# EAGLE design Z05_C8V_03 (EAGLE 6.3)
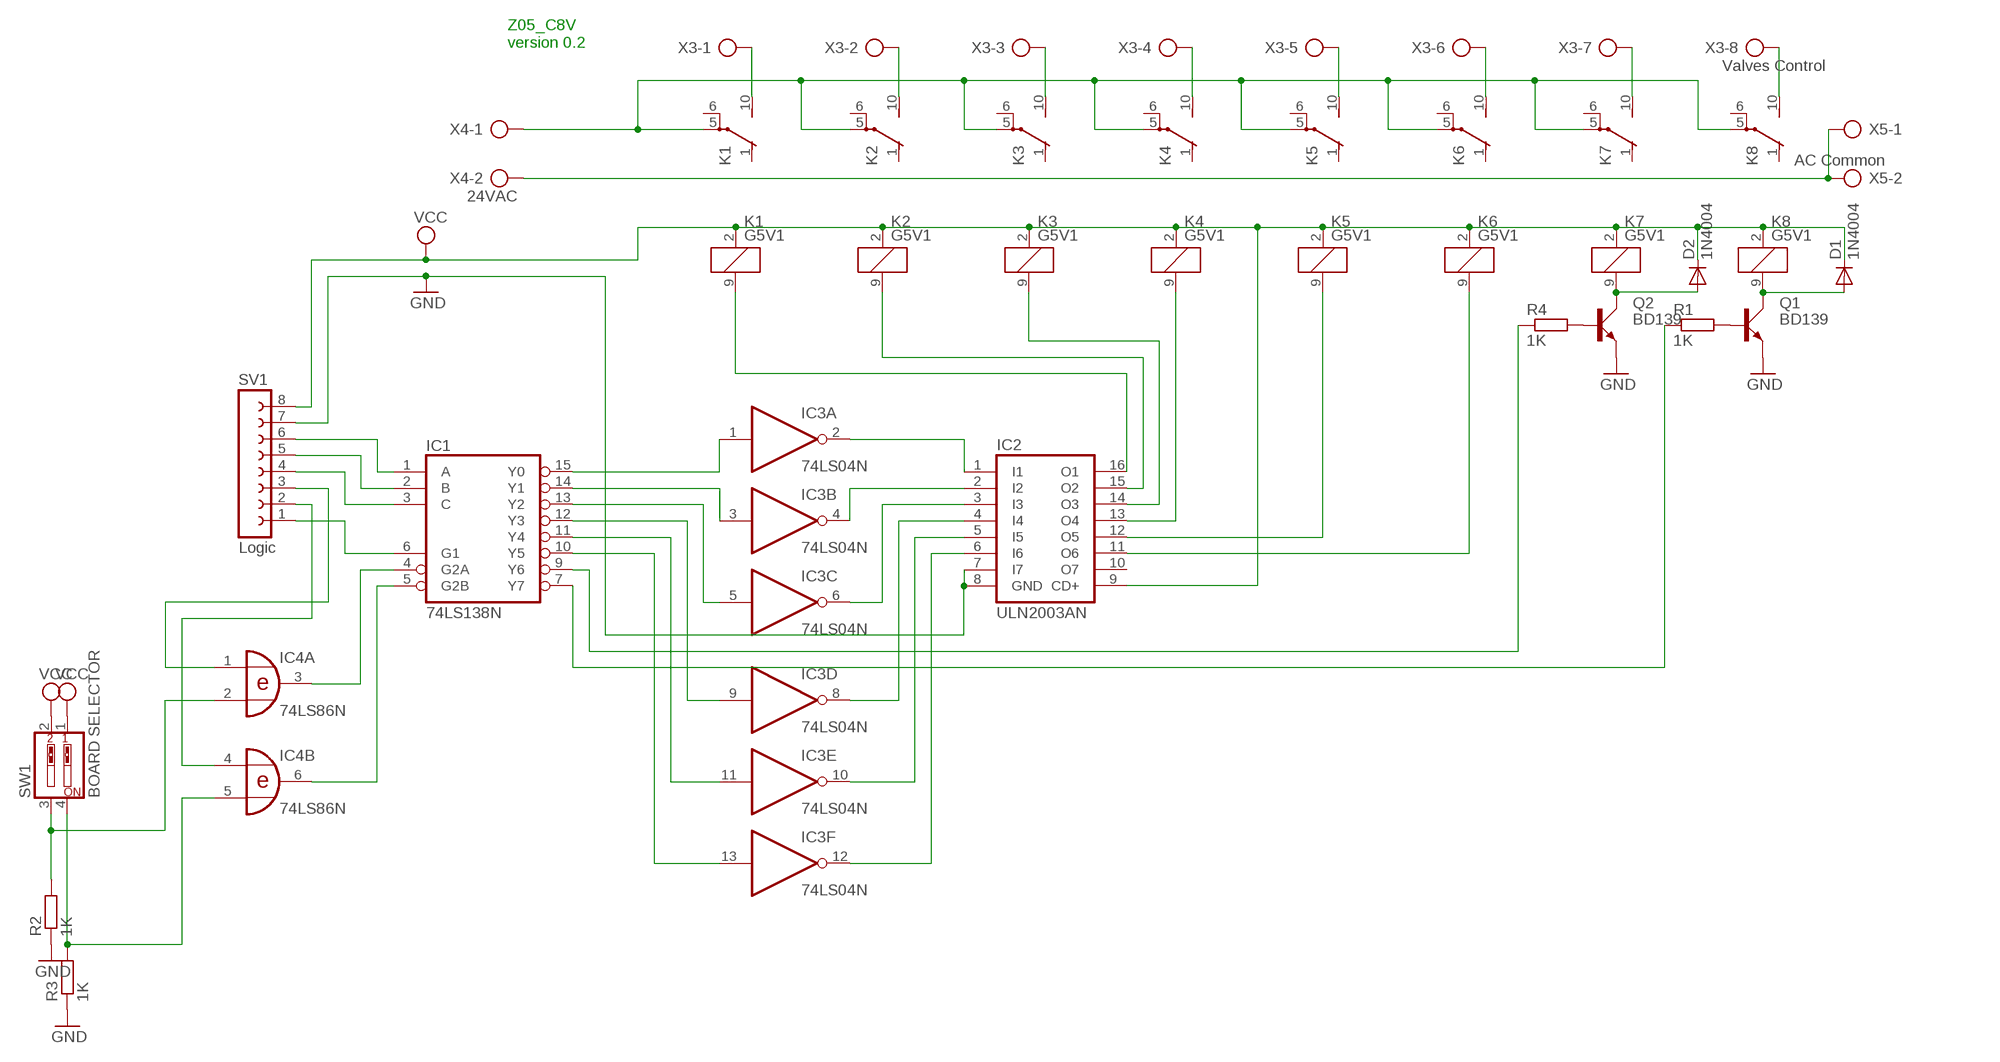
[diagram p0: schematic, sheet 1]

## Parts
D1  1N4004  [DO41-10]
D2  1N4004  [DO41-10]
IC1  74LS138N  [DIL16]
IC2  ULN2003AN  [DIL16]
IC3  74LS04N  [DIL14]
IC4  74LS86N  [DIL14]
K1  G5V1  [G5V1]
K2  G5V1  [G5V1]
K3  G5V1  [G5V1]
K4  G5V1  [G5V1]
K5  G5V1  [G5V1]
K6  G5V1  [G5V1]
K7  G5V1  [G5V1]
K8  G5V1  [G5V1]
Q1  BD139  [TO126AV]
Q2  BD139  [TO126AV]
R1  1K  R-EU_0204/7  [0204/7]
R2  1K  R-EU_0204/7  [0204/7]
R3  1K  R-EU_0204/7  [0204/7]
R4  1K  R-EU_0204/7  [0204/7]
SV1  Logic  FE08-1  [FE08]
SW1  BOARD SELECTOR  SW_DIP-2  [EDG-02]
X3  Valves Control  AK500/8  [AK500/8]
X4  24VAC  AK500/2  [AK500/2]
X5  AC Common  AK500/2  [AK500/2]

## Nets
GND: IC2.7(I7) IC2.8(GND) Q1.E Q2.E R2.1 R3.1 SV1.7
N$1: IC2.15(O2) K2.9
N$2: IC1.15(Y0) IC3.1(A:I)
N$3: IC1.14(Y1) IC3.3(B:I)
N$4: IC1.13(Y2) IC3.5(C:I)
N$5: IC1.12(Y3) IC3.9(D:I)
N$6: IC1.11(Y4) IC3.11(E:I)
N$7: IC1.10(Y5) IC3.13(F:I)
N$8: K1.5(2:P) K2.5(2:P) K3.5(2:P) K4.5(2:P) K5.5(2:P) K6.5(2:P) K7.5(2:P) K8.5(2:P) X4.1
N$9: IC4.1(A:I0) SV1.3
N$10: X4.2 X5.1 X5.2
N$11: K1.10(2:S) X3.1
N$12: K2.10(2:S) X3.2
N$13: K3.10(2:S) X3.3
N$14: K4.10(2:S) X3.4
N$15: K5.10(2:S) X3.5
N$16: K6.10(2:S) X3.6
N$17: K7.10(2:S) X3.7
N$18: K8.10(2:S) X3.8
N$19: IC4.4(B:I0) SV1.2
N$20: D1.A K8.9 Q1.C
N$21: IC2.16(O1) K1.9
N$22: Q1.B R1.2
N$23: IC1.7(Y7) R1.1
N$24: IC2.14(O3) K3.9
N$25: IC2.13(O4) K4.9
N$26: IC2.12(O5) K5.9
N$27: IC2.11(O6) K6.9
N$28: IC1.9(Y6) R4.1
N$29: D2.A K7.9 Q2.C
N$30: IC4.5(B:I1) R3.2 SW1.4
N$31: IC1.4(G2A) IC4.3(A:O)
N$32: IC1.5(G2B) IC4.6(B:O)
N$33: IC4.2(A:I1) R2.2 SW1.3
N$35: IC2.1(I1) IC3.2(A:O)
N$36: IC2.2(I2) IC3.4(B:O)
N$37: IC2.3(I3) IC3.6(C:O)
N$38: IC2.4(I4) IC3.8(D:O)
N$39: IC2.5(I5) IC3.10(E:O)
N$40: IC2.6(I6) IC3.12(F:O)
N$41: Q2.B R4.2
N$42: IC1.1(A) SV1.6
N$43: IC1.2(B) SV1.5
N$44: IC1.3(C) SV1.4
N$45: IC1.6(G1) SV1.1
VCC: D1.C D2.C IC2.9(CD+) K1.2 K2.2 K3.2 K4.2 K5.2 K6.2 K7.2 K8.2 SV1.8 SW1.1 SW1.2
Unconnected: IC2.10(O7) IC4.8(C:O) IC4.9(C:I0) IC4.10(C:I1) IC4.11(D:O) IC4.12(D:I0) IC4.13(D:I1) K1.1(2:O) K1.6(2:P) K2.1(2:O) K2.6(2:P) K3.1(2:O) K3.6(2:P) K4.1(2:O) K4.6(2:P) K5.1(2:O) K5.6(2:P) K6.1(2:O) K6.6(2:P) K7.1(2:O) K7.6(2:P) K8.1(2:O) K8.6(2:P)

## Notes on the sheet
- Z05_C8V
  version 0.2

## Power pins joined to a net without a drawn wire
GND: IC1.8(GND) IC3.7(P:GND) IC4.7(P:GND)
VCC: IC1.16(VCC) IC3.14(P:VCC) IC4.14(P:VCC)

## Library data of the parts
D1 D2 = diode:1N4004: DIODE general purpose rectifier, 1 A
IC1 = 74xx-eu:74*138: 3-line to 8-line DECODER/DEMULTIPLEXER
IC2 = uln-udn:ULN2003A: DRIVER ARRAY
IC3 = 74xx-eu:74*04: Hex INVERTER
IC4 = 74xx-eu:74*86: Quad 2-input EXCLUSIVE-OR (XOR) gate
K1-K8 = relay:G5V1: RELAY 1 x switch, 0.5 A/125 V AC, 1 A/24 V DC , Omron; MPN: G5V-1-DC24; OC_FARNELL: 9949593; OC_NEWARK: 36M6377
Q1 Q2 = transistor-power:BD139: NPN TRANSISTOR
R1-R4 = rcl:R-EU_: RESISTOR, European symbol
SV1 = con-lsta:FE08-1: FEMALE HEADER; OC_FARNELL: unknown; OC_NEWARK: unknown
SW1 = special:SW_DIP-2: DIP SWITCH
X3 = con-ptr500:AK500/8: CONNECTOR; OC_FARNELL: unknown; OC_NEWARK: unknown
X4 X5 = con-ptr500:AK500/2: CONNECTOR; OC_FARNELL: unknown; OC_NEWARK: unknown

## Board
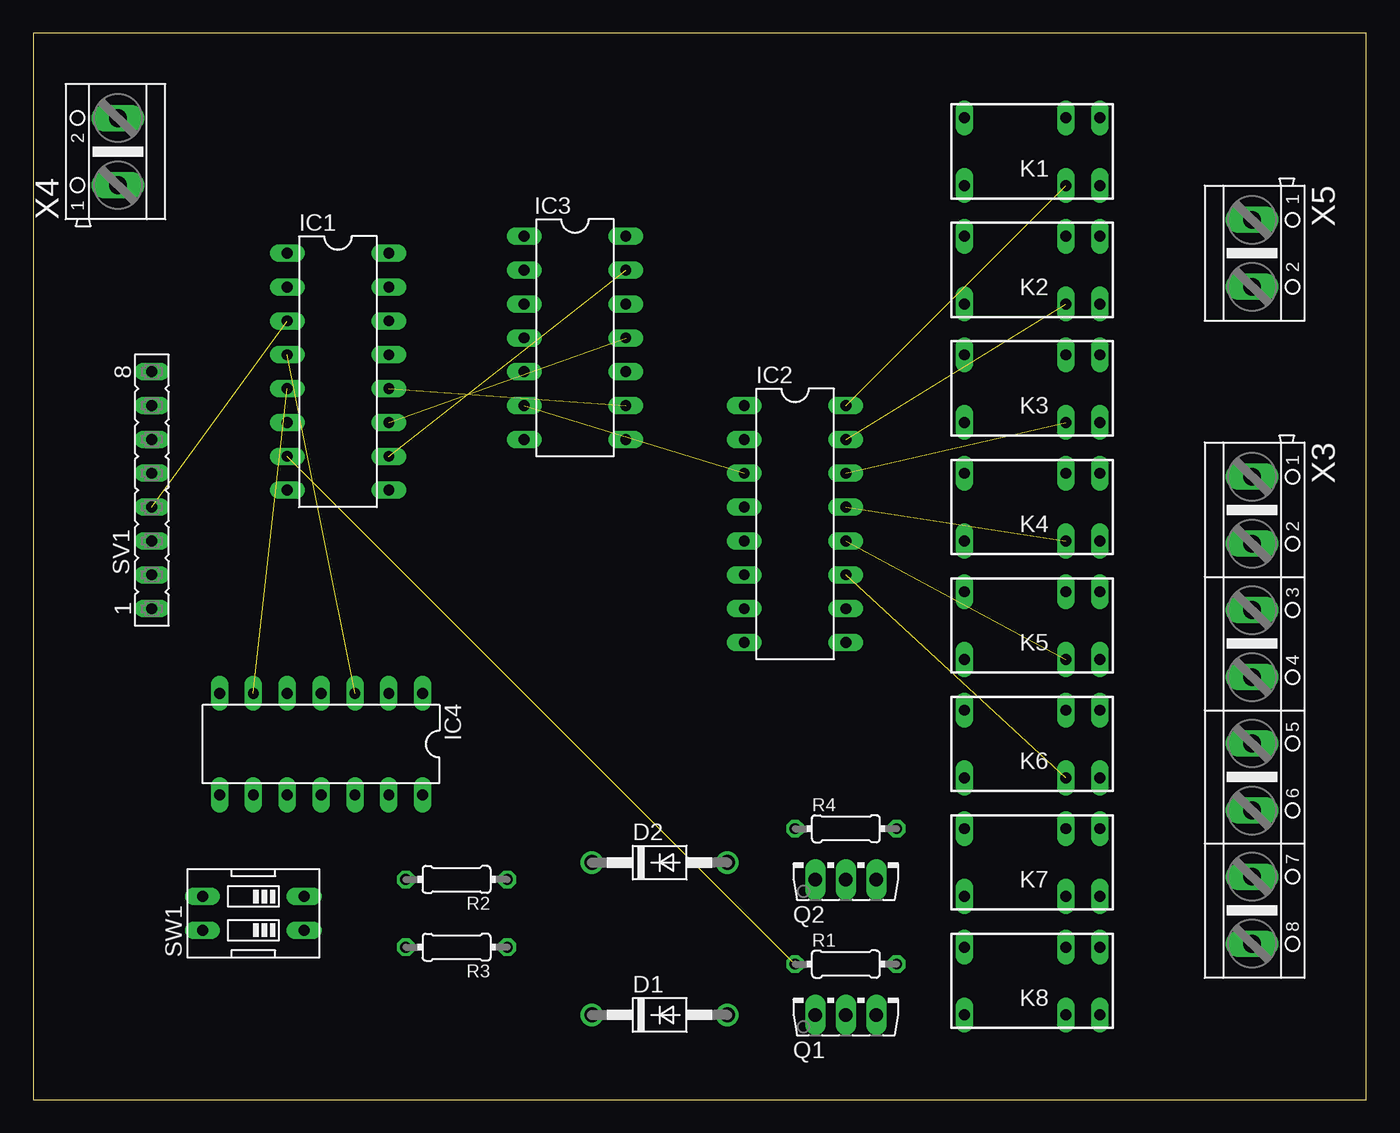
[diagram p1: board, top side]
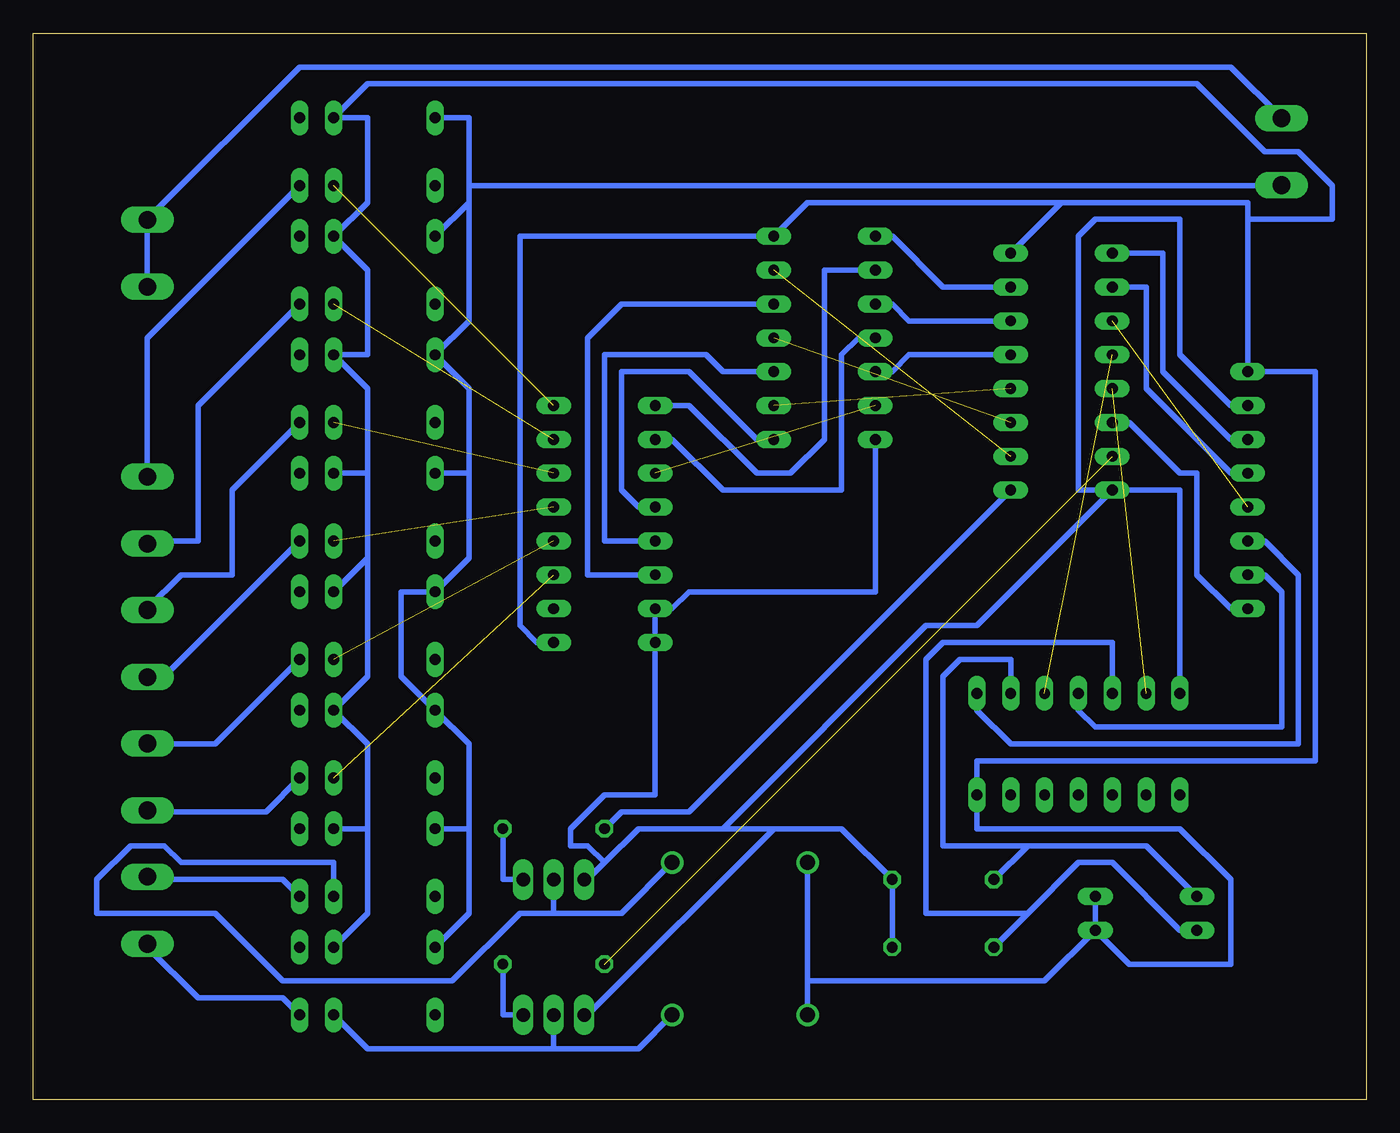
[diagram p2: board, bottom side, seen from below]

Size 100 x 80 mm. Coordinates in mm from the lower left corner, seen from the top.
Outline: 0,0 100,0 100,80 0,80 0,0
Copper layers (1*16): Top 0.035mm / dielectric 1.5mm / Bottom 0.035mm
Design rules "default *": minimum track width 16mil, minimum drill 24mil, track to track 24mil, track to pad 24mil, pad to pad 24mil, via to via 24mil, smd to smd 8mil, copper to edge 40mil, drill to drill 24mil, minimum pad ring 10mil, minimum via ring 8mil, stop-mask expansion 4mil, vias tented up to drill 0mil, thermal gap 10mil

### Footprints (pad centres in the part's own frame; a part is rotated, then mirrored left to right if it is on the bottom)
DO41-10 = drill 1.118: A 5.08,0; C -5.08,0
DIL16 = drill 0.813 long: 1 -8.89,-3.81; 2 -6.35,-3.81; 3 -3.81,-3.81; 4 -1.27,-3.81; 5 1.27,-3.81; 6 3.81,-3.81; 7 6.35,-3.81; 8 8.89,-3.81; 9 8.89,3.81; 10 6.35,3.81; 11 3.81,3.81; 12 1.27,3.81; 13 -1.27,3.81; 14 -3.81,3.81; 15 -6.35,3.81; 16 -8.89,3.81
DIL14 = drill 0.813 long: 1 -7.62,-3.81; 2 -5.08,-3.81; 3 -2.54,-3.81; 4 0,-3.81; 5 2.54,-3.81; 6 5.08,-3.81; 7 7.62,-3.81; 8 7.62,3.81; 9 5.08,3.81; 10 2.54,3.81; 11 0,3.81; 12 -2.54,3.81; 13 -5.08,3.81; 14 -7.62,3.81
G5V1 = drill 0.813 long: 1 -5.08,-2.54; 2 -2.54,-2.54; 5 5.08,-2.54; 6 5.08,2.54; 9 -2.54,2.54; 10 -5.08,2.54
TO126AV = drill 1.016 long: B 2.286,-1.27; C 0,-1.27; E -2.286,-1.27
0204/7 = drill 0.813 octagon: 1 -3.81,0; 2 3.81,0
FE08 = drill 0.813 long: 1 -8.89,0; 2 -6.35,0; 3 -3.81,0; 4 -1.27,0; 5 1.27,0; 6 3.81,0; 7 6.35,0; 8 8.89,0
EDG-02 = drill 0.813 long: 1 -1.27,-3.81; 2 1.27,-3.81; 3 1.27,3.81; 4 -1.27,3.81
AK500/8 = drill 1.321 long: 1 -17.526,0; 2 -12.497,0; 3 -7.518,0; 4 -2.489,0; 5 2.489,0; 6 7.518,0; 7 12.497,0; 8 17.526,0
AK500/2 = drill 1.321 long: 1 -2.515,0; 2 2.515,0

### Placement (x,y rotation side)
D1  46.99,6.35 0 top
D2  46.99,17.78 0 top
IC1  22.86,54.61 270 top
IC2  57.15,43.18 270 top
IC3  40.64,57.15 270 top
IC4  21.59,26.67 180 top
K1  74.93,71.12 180 top
K2  74.93,62.23 180 top
K3  74.93,53.34 180 top
K4  74.93,44.45 180 top
K5  74.93,35.56 180 top
K6  74.93,26.67 180 top
K7  74.93,17.78 180 top
K8  74.93,8.89 180 top
Q1  60.96,7.62 0 top
Q2  60.96,17.78 0 top
R1  60.96,10.16 0 top
R2  31.75,16.51 180 top
R3  31.75,11.43 180 top
R4  60.96,20.32 0 top
SV1  8.89,45.72 90 top
SW1  16.51,13.97 90 top
X3  91.44,29.21 270 top
X4  6.35,71.12 90 top
X5  91.44,63.5 270 top

### Tracks (layer width: path | path; a pad name or v marks a point on that pad's centre or on a via)
GND
  Bottom 0.406: IC4.7 13.97,45.72 IC1.8 | SV1.7 10.16,52.07 13.97,55.88 13.97,66.04 20.32,66.04 21.59,64.77 21.59,45.72 IC1.8 | IC3.7 36.83,38.1 50.8,38.1 52.07,36.83 IC2.7 IC2.8 53.34,22.86 57.15,22.86 59.69,20.32 59.69,19.05 58.42,19.05 57.15,17.78 | R3.1 R2.1 39.37,20.32 44.45,20.32 | 44.45,20.32 58.42,6.35 Q1.E | 57.15,17.78 54.61,20.32 48.26,20.32 | 57.15,17.78 58.42,16.51 Q2.E | 44.45,20.32 48.26,20.32 | IC1.8 29.21,35.56 33.02,35.56 48.26,20.32
N$1  (1 unrouted)
N$2
  Bottom 0.406: IC1.15 31.75,60.96 35.56,64.77 IC3.1
N$3
  Bottom 0.406: IC1.14 34.29,58.42 35.56,59.69 IC3.3
N$4
  Bottom 0.406: IC1.13 34.29,55.88 35.56,54.61 IC3.5
N$5  (1 unrouted)
N$6  (1 unrouted)
N$7  (1 unrouted)
N$8
  Bottom 0.406: K8.5 67.31,13.97 67.31,20.32 | K7.5 67.31,20.32 | 67.31,20.32 67.31,26.67 K6.5 72.39,31.75 72.39,38.1 K5.5 67.31,40.64 67.31,46.99 | K4.5 67.31,46.99 | 67.31,46.99 67.31,53.34 K3.5 67.31,58.42 67.31,67.31 | 67.31,67.31 K2.5 | 67.31,68.58 67.31,73.66 K1.5 | 67.31,68.58 67.31,67.31 | 67.31,68.58 6.35,68.58 X4.1
N$9
  Bottom 0.406: SV1.3 7.62,41.91 5.08,39.37 5.08,26.67 26.67,26.67 29.21,29.21 IC4.1
N$10
  Bottom 0.406: X4.2 6.35,73.66 10.16,77.47 80.01,77.47 91.44,66.04 X5.1 X5.2 91.44,60.96
N$11
  Bottom 0.406: K1.10 91.44,57.15 X3.1
N$12
  Bottom 0.406: K2.10 87.63,52.07 87.63,41.91 91.44,41.91 X3.2
N$13
  Bottom 0.406: K3.10 85.09,45.72 85.09,39.37 88.9,39.37 91.44,36.83 X3.3
N$14
  Bottom 0.406: K4.10 90.17,31.75 91.44,31.75 X3.4
N$15
  Bottom 0.406: K5.10 86.36,26.67 91.44,26.67 X3.5
N$16
  Bottom 0.406: K6.10 82.55,21.59 91.44,21.59 X3.6
N$17
  Bottom 0.406: K7.10 81.28,16.51 91.44,16.51 X3.7
N$18
  Bottom 0.406: K8.10 81.28,7.62 87.63,7.62 91.44,11.43 X3.8
N$19
  Bottom 0.406: SV1.2 7.62,39.37 6.35,38.1 6.35,27.94 20.32,27.94 21.59,29.21 IC4.4
N$20
  Bottom 0.406: K8.9 74.93,3.81 60.96,3.81 | 60.96,3.81 54.61,3.81 D1.A | 60.96,3.81 Q1.C
N$21  (1 unrouted)
N$22
  Bottom 0.406: R1.2 64.77,6.35 Q1.B
N$23  (1 unrouted)
N$24  (1 unrouted)
N$25  (1 unrouted)
N$26  (1 unrouted)
N$27  (1 unrouted)
N$28
  Bottom 0.406: IC1.9 50.8,21.59 55.88,21.59 R4.1
N$29
  Bottom 0.406: K7.9 77.47,17.78 88.9,17.78 90.17,19.05 92.71,19.05 95.25,16.51 95.25,13.97 86.36,13.97 81.28,8.89 68.58,8.89 63.5,13.97 60.96,13.97 | 60.96,13.97 55.88,13.97 D2.A | 60.96,13.97 Q2.C
N$30
  Bottom 0.406: SW1.4 13.97,12.7 19.05,17.78 21.59,17.78 25.4,13.97 | R3.2 25.4,13.97 | IC4.5 19.05,34.29 31.75,34.29 33.02,33.02 33.02,13.97 25.4,13.97
N$31  (1 unrouted)
N$32  (1 unrouted)
N$33
  Bottom 0.406: SW1.3 16.51,19.05 25.4,19.05 | R2.2 25.4,19.05 | IC4.2 26.67,33.02 30.48,33.02 31.75,31.75 31.75,19.05 25.4,19.05
N$35
  Bottom 0.406: IC2.1 50.8,52.07 45.72,46.99 43.18,46.99 40.64,49.53 40.64,62.23 IC3.2
N$36
  Bottom 0.406: IC3.4 38.1,57.15 39.37,55.88 39.37,45.72 48.26,45.72 52.07,49.53 IC2.2
N$37  (1 unrouted)
N$38
  Bottom 0.406: IC2.4 54.61,44.45 55.88,45.72 55.88,54.61 50.8,54.61 45.72,49.53 IC3.8
N$39
  Bottom 0.406: IC3.10 48.26,54.61 49.53,55.88 57.15,55.88 57.15,41.91 IC2.5
N$40
  Bottom 0.406: IC3.12 55.88,59.69 58.42,57.15 58.42,39.37 IC2.6
N$41
  Bottom 0.406: R4.2 64.77,16.51 Q2.B
N$42
  Bottom 0.406: SV1.6 10.16,49.53 15.24,54.61 15.24,63.5 IC1.1
N$43
  Bottom 0.406: SV1.5 10.16,46.99 16.51,53.34 16.51,60.96 IC1.2
N$44  (1 unrouted)
N$45
  Bottom 0.406: SV1.1 10.16,36.83 12.7,39.37 12.7,46.99 13.97,46.99 17.78,50.8 IC1.6
VCC
  Bottom 0.406: K8.2 74.93,13.97 74.93,20.32 | K7.2 74.93,20.32 | 74.93,20.32 74.93,26.67 K6.2 74.93,31.75 74.93,40.64 | 74.93,40.64 K5.2 | 74.93,46.99 74.93,40.64 | K4.2 74.93,46.99 | 74.93,46.99 74.93,53.34 K3.2 74.93,55.88 74.93,62.23 K2.2 74.93,67.31 74.93,73.66 K1.2 74.93,76.2 12.7,76.2 7.62,71.12 5.08,71.12 2.54,68.58 2.54,66.04 8.89,66.04 | D2.C 41.91,8.89 | 41.91,8.89 D1.C | SW1.2 SW1.1 | SW1.1 17.78,10.16 10.16,10.16 10.16,16.51 13.97,20.32 29.21,20.32 IC4.14 29.21,25.4 3.81,25.4 3.81,54.61 SV1.8 8.89,66.04 | 41.91,8.89 24.13,8.89 SW1.1 | 8.89,66.04 8.89,67.31 22.86,67.31 | IC1.16 22.86,67.31 | 22.86,67.31 41.91,67.31 IC3.14 63.5,64.77 63.5,35.56 62.23,34.29 IC2.9